# Altium project Adapter.PrjPCB
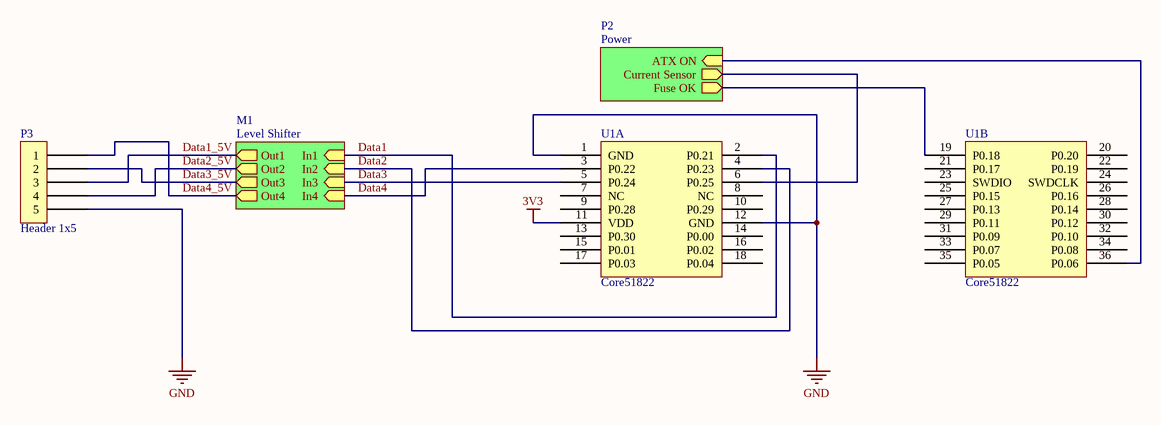
[diagram p0: Top.SchDoc]
1 sheet, 2 parts. Net scope: hierarchical (ports join the sheet entries above them; power ports are global).
Board file: Adapter.PcbDoc

## Sheet Top.SchDoc
size A4

### Parts
P3  Header 1x5  [Header 1x5 male]
U1  Core51822  [Core51822]  (parts A,B of 2)

### Sub-sheets
M1 = Level Shifter (file not in this document): In1 (in), In4 (in), In3 (in), In2 (in), Out1 (out), Out3 (out), Out2 (out), Out4 (out)
P2 = Power (file not in this document): Current Sensor (out), Fuse OK (out), ATX ON (in)

### Nets
3V3: U1.11(VDD)
GND: P3.5 U1.1(GND) U1.12(GND)
Data1: U1.2(P0.21) ; sheet M1/In1
Data1_5V: P3.3 ; sheet M1/Out1
Data2: U1.4(P0.23) ; sheet M1/In2
Data2_5V: P3.4 ; sheet M1/Out2
Data3: U1.5(P0.24) ; sheet M1/In3
Data3_5V: P3.2 ; sheet M1/Out3
Data4: U1.3(P0.22) ; sheet M1/In4
Data4_5V: P3.1 ; sheet M1/Out4
NetU1_6: U1.6(P0.25) ; sheet P2/Current Sensor
NetU1_19: U1.19(P0.18) ; sheet P2/Fuse OK
NetU1_36: U1.36(P0.06) ; sheet P2/ATX ON

Not connected (* = marked no-connect by the designer): U1 7(NC) 8(NC) 9(P0.28) 10(P0.29) 13(P0.30) 14(P0.00) 15(P0.01) 16(P0.02) 17(P0.03) 18(P0.04) 20(P0.20) 21(P0.17) 22(P0.19) 23(SWDIO) 24(SWDCLK) 25(P0.15) 26(P0.16) 27(P0.13) 28(P0.14) 29(P0.11) 30(P0.12) 31(P0.09) 32(P0.10) 33(P0.07) 34(P0.08) 35(P0.05)